# EAGLE design line-sensor (EAGLE 6.0)
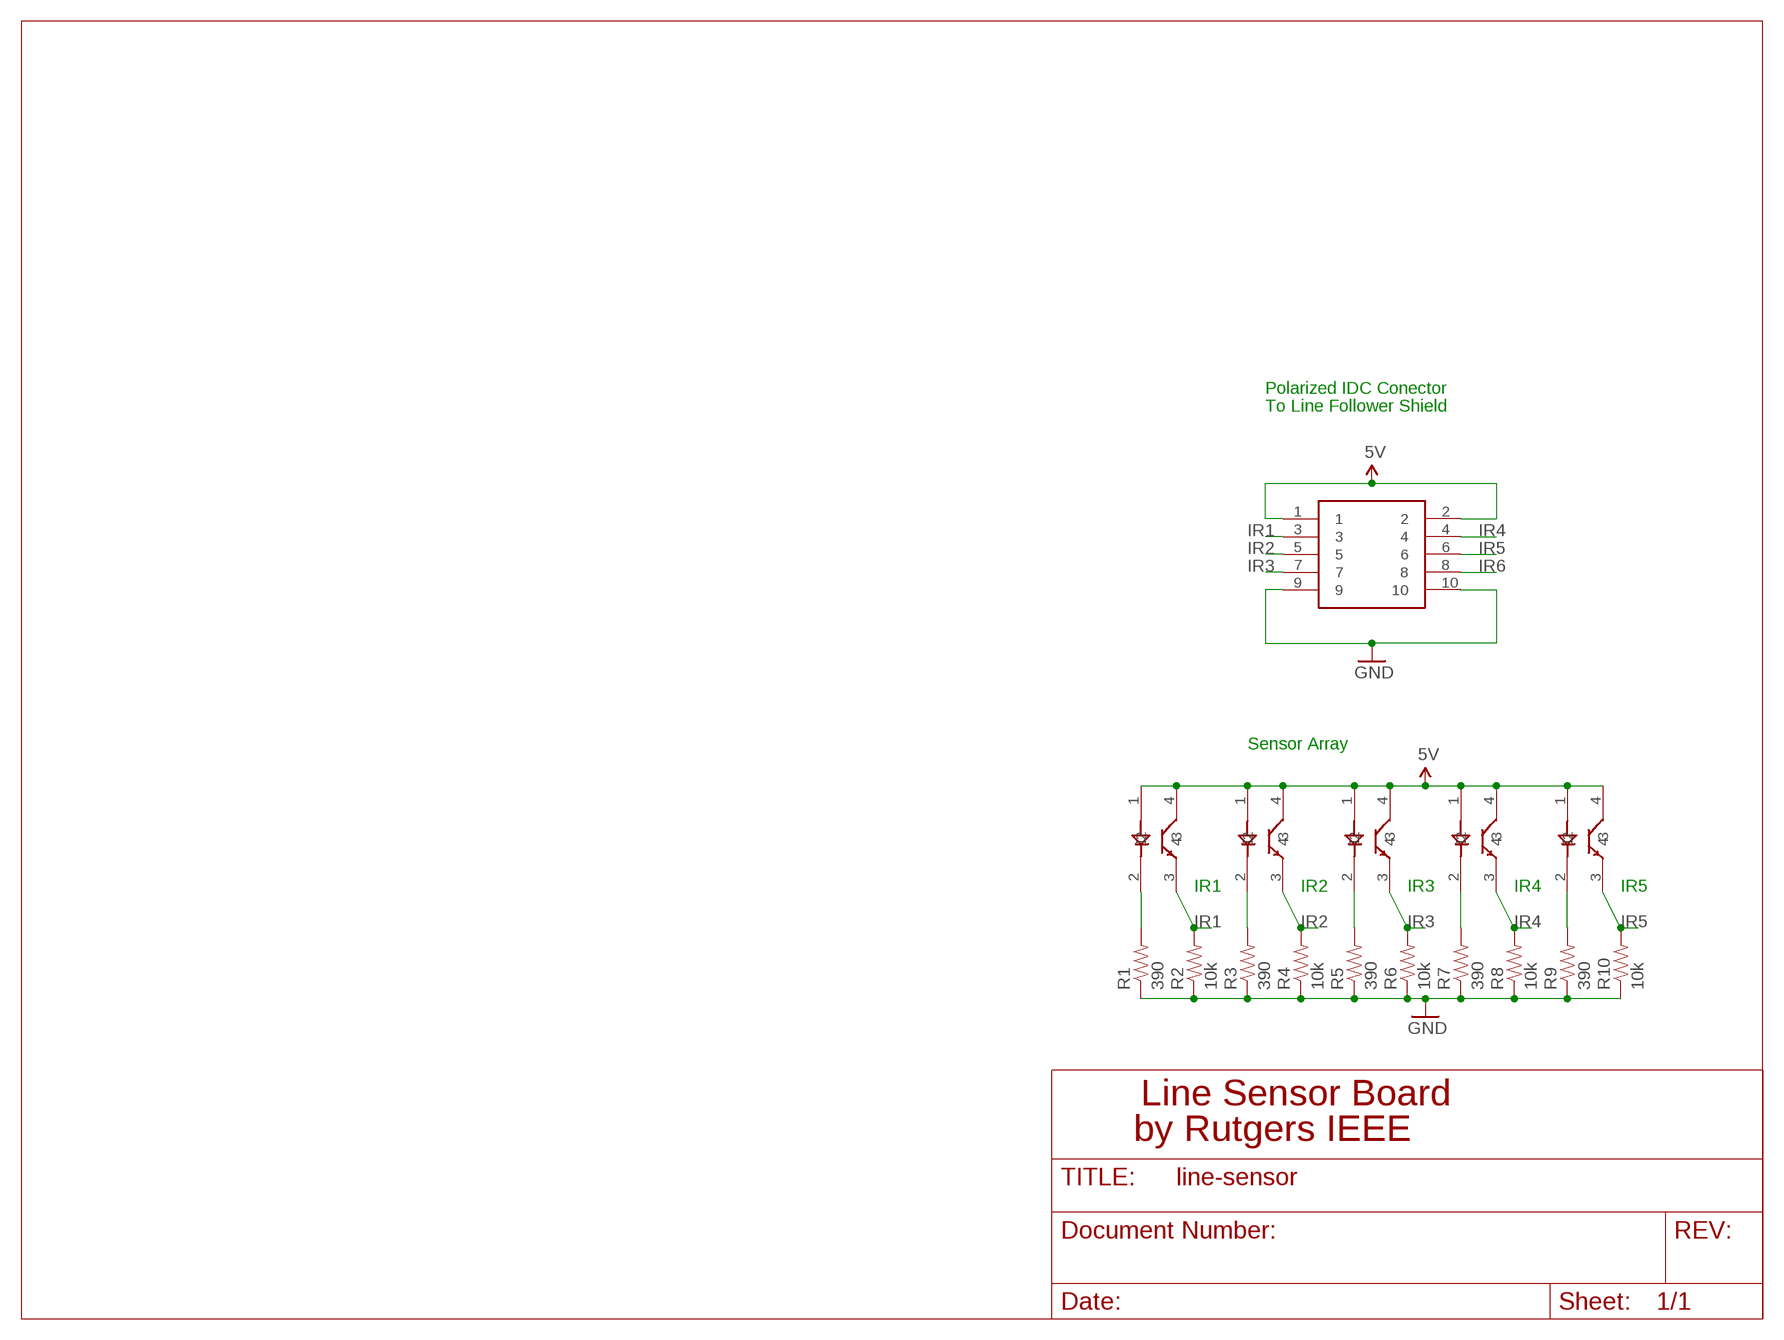
[diagram p0: schematic, sheet 1]

## Parts
R1  390  RESISTORPTH1  [AXIAL-0.3]
R2  10k  RESISTORPTH1  [AXIAL-0.3]
R3  390  RESISTORPTH1  [AXIAL-0.3]
R4  10k  RESISTORPTH1  [AXIAL-0.3]
R5  390  RESISTORPTH1  [AXIAL-0.3]
R6  10k  RESISTORPTH1  [AXIAL-0.3]
R7  390  RESISTORPTH1  [AXIAL-0.3]
R8  10k  RESISTORPTH1  [AXIAL-0.3]
R9  390  RESISTORPTH1  [AXIAL-0.3]
R10  10k  RESISTORPTH1  [AXIAL-0.3]
U$1  IR1  RPR220  [RPR220]
U$2  IR2  RPR220  [RPR220]
U$3  IR3  RPR220  [RPR220]
U$4  IR4  RPR220  [RPR220]
U$5  IR5  RPR220  [RPR220]
U$8  2X5-PHEADER  [2X5-SHROUDED-HEADER]

## Nets
5V: U$1.1 U$1.4 U$2.1 U$2.4 U$3.1 U$3.4 U$4.1 U$4.4 U$5.1 U$5.4 U$8.1 U$8.2
GND: R1.P$1 R2.P$1 R3.P$1 R4.P$1 R5.P$1 R6.P$1 R7.P$1 R8.P$1 R9.P$1 R10.P$1 U$8.9 U$8.10
IR1: R2.P$2 U$1.3 U$8.3
IR2: R4.P$2 U$2.3 U$8.5
IR3: R6.P$2 U$3.3 U$8.7
IR4: R8.P$2 U$4.3 U$8.4
IR5: R10.P$2 U$5.3 U$8.6
IR6: U$8.8
N$2: R1.P$2 U$1.2
N$4: R3.P$2 U$2.2
N$6: R5.P$2 U$3.2
N$9: R7.P$2 U$4.2
N$10: R9.P$2 U$5.2

## Notes on the sheet
- Polarized IDC Conector
- To Line Follower Shield
- Sensor Array
- IR1 | IR2 | IR3 | IR4 | IR5
- Line Sensor Board
- by Rutgers IEEE

## Library data of the parts
R1-R10 = SparkFun:RESISTOR: Resistor Basic schematic elements and footprints for 0603, 1206, and PTH 1/10th watt (small) resistors.
U$1-U$5 = linelib:RPR220
U$8 = linelib:2X5-PHEADER

## Board
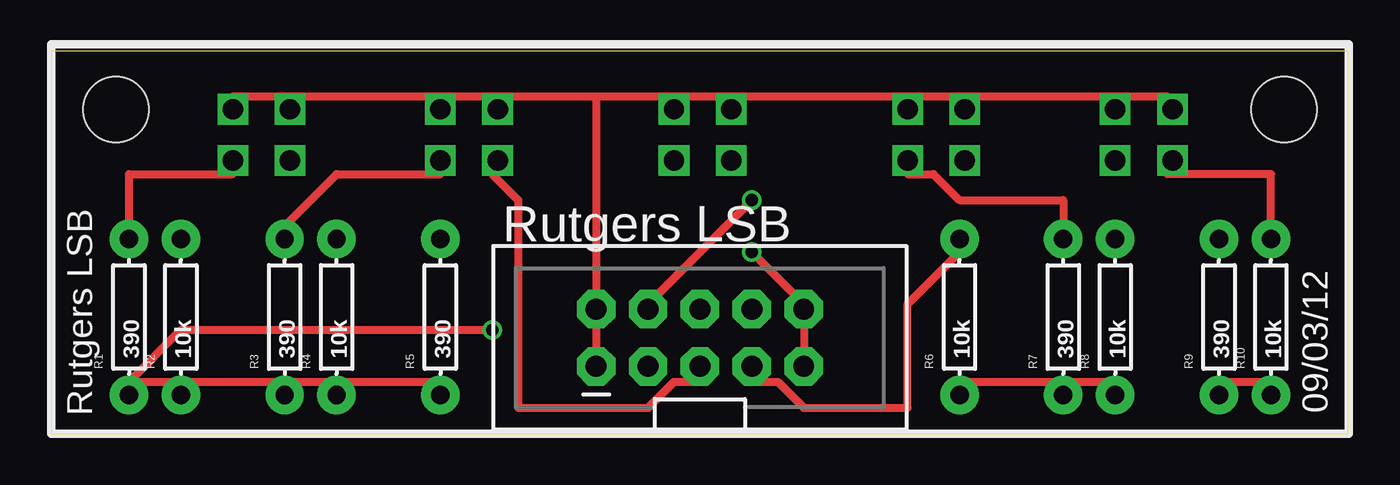
[diagram p1: board, top side]
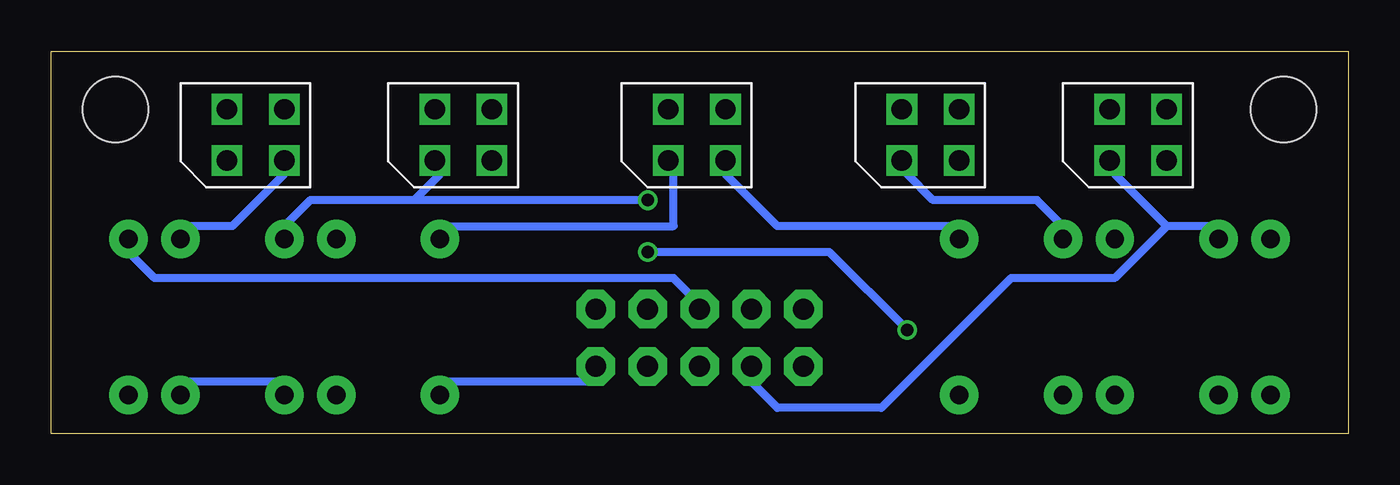
[diagram p2: board, bottom side, seen from below]

Size 63.48 x 18.72 mm. Coordinates in mm from the lower left corner, seen from the top.
Outline: 0,0 63.48,0 63.48,18.72 0,18.72 0,0
Copper layers (1*16): Top 0.0356mm / dielectric 1.5011mm / Bottom 0.0356mm
Design rules: minimum track width 6mil, minimum drill 13mil, track to track 6mil, track to pad 6mil, pad to pad 6mil, via to via 6mil, smd to smd 6mil, copper to edge 15mil, drill to drill 6mil, minimum pad ring 7mil, minimum via ring 7mil, stop-mask expansion 4mil, vias tented up to drill 0mil, thermal gap 10mil
Holes 3.2 mm at 3.17,15.88 60.33,15.88

### Footprints (pad centres in the part's own frame; a part is rotated, then mirrored left to right if it is on the bottom)
AXIAL-0.3 = drill 0.9 pad 1.88: P$1 -3.81,0; P$2 3.81,0
RPR220 = drill 1 square: 1 0,0; 2 0,-2.5; 3 2.8,-2.5; 4 2.8,0
2X5-SHROUDED-HEADER = drill 1.016 pad 1.88 octagon: 1 3.683,15.24; 2 6.477,15.24; 3 3.683,12.7; 4 6.477,12.7; 5 3.683,10.16; 6 6.477,10.16; 7 3.683,7.62; 8 6.477,7.62; 9 3.683,5.08; 10 6.477,5.08

### Placement (x,y rotation side)
R1  3.81,5.71 90 top
R2  6.35,5.71 90 top
R3  11.43,5.71 90 top
R4  13.97,5.71 90 top
R5  19.05,5.71 90 top
R6  44.45,5.71 90 top
R7  49.53,5.71 90 top
R8  52.07,5.71 90 top
R9  57.15,5.71 90 top
R10  59.69,5.71 90 top
U$1  8.89,15.88 0 top
U$2  19.05,15.88 0 top
U$3  30.48,15.88 0 top
U$4  41.91,15.88 0 top
U$5  52.07,15.88 0 top
U$8  41.91,-0.38 90 top

### Tracks (layer width: path | path; a pad name or v marks a point on that pad's centre or on a via)
5V
  Top 0.4: 41.91,16.51 44.45,16.51 | 52.07,16.51 54.61,16.51 U$5.4 | 44.45,16.51 52.07,16.51 | 44.45,16.51 U$4.4 | 52.07,16.51 U$5.1 | U$8.1 U$8.2 26.67,6.35 26.67,16.51 | 30.48,16.51 33.02,16.51 | 11.43,16.51 8.89,16.51 U$1.1 | 19.05,16.51 21.59,16.51 | 11.43,16.51 19.05,16.51 | 11.43,16.51 U$1.4 | 19.05,16.51 U$2.1 | 21.59,16.51 26.67,16.51 | 26.67,16.51 30.48,16.51 | 30.48,16.51 U$3.1 | 21.59,16.51 U$2.4 | 33.02,16.51 41.91,16.51 | 41.91,16.51 U$4.1 | 33.02,16.51 U$3.4
GND  (via drill 0.61)
  Top 0.4: 3.81,2.54 6.35,2.54 | 11.43,2.54 13.97,2.54 | 13.97,2.54 19.05,2.54 R5.P$1 | 13.97,2.54 R4.P$1 | 6.35,2.54 11.43,2.54 | 6.35,2.54 R2.P$1 | 11.43,2.54 R3.P$1 | U$8.9 U$8.10 36.83,6.35 v34.29,8.89 | R9.P$1 57.15,2.54 59.69,2.54 R10.P$1 | 49.53,2.54 44.45,2.54 R6.P$1 | 49.53,2.54 52.07,2.54 R8.P$1 | 49.53,2.54 R7.P$1 | 3.81,2.54 6.35,5.08 v21.59,5.08 | R1.P$1 3.81,2.54
  Bottom 0.4: R9.P$1 57.15,2.54 52.07,2.54 R8.P$1 | U$8.9 36.83,2.54 44.45,2.54 R6.P$1 | v21.59,5.08 25.4,8.89 v34.29,8.89
IR1
  Bottom 0.4: 8.89,10.16 11.43,12.7 U$1.3 | 8.89,10.16 6.35,10.16 R2.P$2 | 8.89,10.16 11.43,7.62 16.51,7.62 22.86,1.27 27.94,1.27 29.21,2.54 U$8.3
IR2
  Top 0.4: U$8.5 31.75,2.54 30.48,2.54 29.21,1.27 22.86,1.27 22.86,11.43 21.59,12.7 U$2.3
  Bottom 0.4: U$2.3 21.59,12.7 20.32,11.43 15.24,11.43 13.97,10.16 R4.P$2
IR3
  Top 0.4: U$8.7 34.29,2.54 35.56,2.54 36.83,1.27 41.91,1.27 41.91,6.35 44.45,8.89 R6.P$2
  Bottom 0.4: U$3.3 33.02,12.7 33.02,10.16 44.45,10.16 R6.P$2
IR4  (via drill 0.61)
  Top 0.4: v34.29,11.43 29.21,6.35 U$8.4
  Bottom 0.4: 45.72,11.43 44.45,12.7 U$4.3 | 45.72,11.43 50.8,11.43 52.07,10.16 R8.P$2 | v34.29,11.43 45.72,11.43
IR5
  Top 0.4: U$5.3 54.61,12.7 59.69,12.7 R10.P$2
  Bottom 0.4: U$8.6 31.75,6.35 33.02,7.62 58.42,7.62 59.69,8.89 R10.P$2
N$2
  Top 0.4: U$1.2 8.89,12.7 3.81,12.7 R1.P$2
N$4
  Top 0.4: U$2.2 19.05,12.7 13.97,12.7 11.43,10.16 R3.P$2
N$6
  Bottom 0.4: U$3.2 30.48,12.7 27.94,10.16 19.05,10.16 R5.P$2
N$9
  Top 0.4: U$4.2 41.91,12.7 43.18,12.7 44.45,11.43 49.53,11.43 R7.P$2
N$10
  Bottom 0.4: U$5.2 52.07,12.7 54.61,10.16 57.15,10.16 R9.P$2

### Text on the board
tPlace: Rutgers LSB | Rutgers LSB | 09/03/12